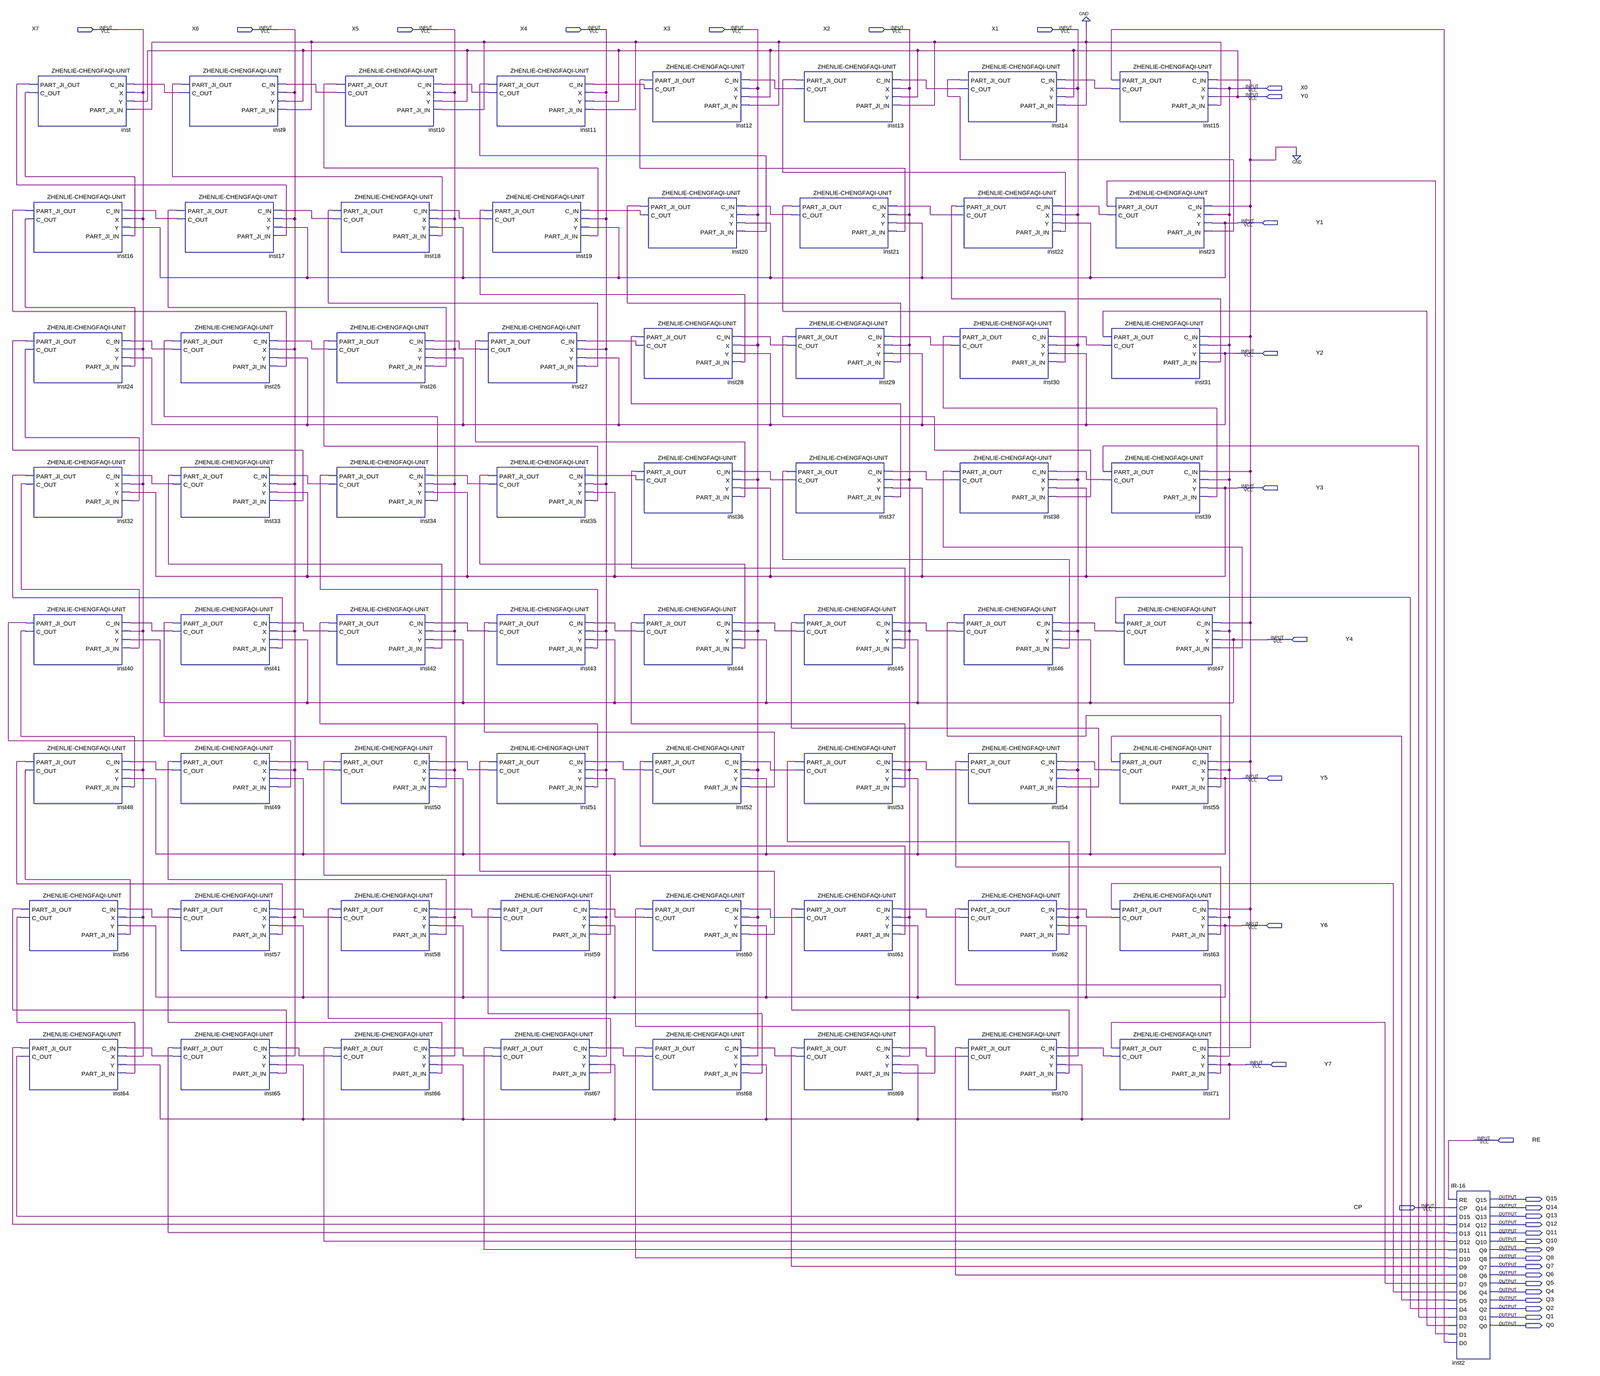
[diagram p0: schematic sheet, whole]
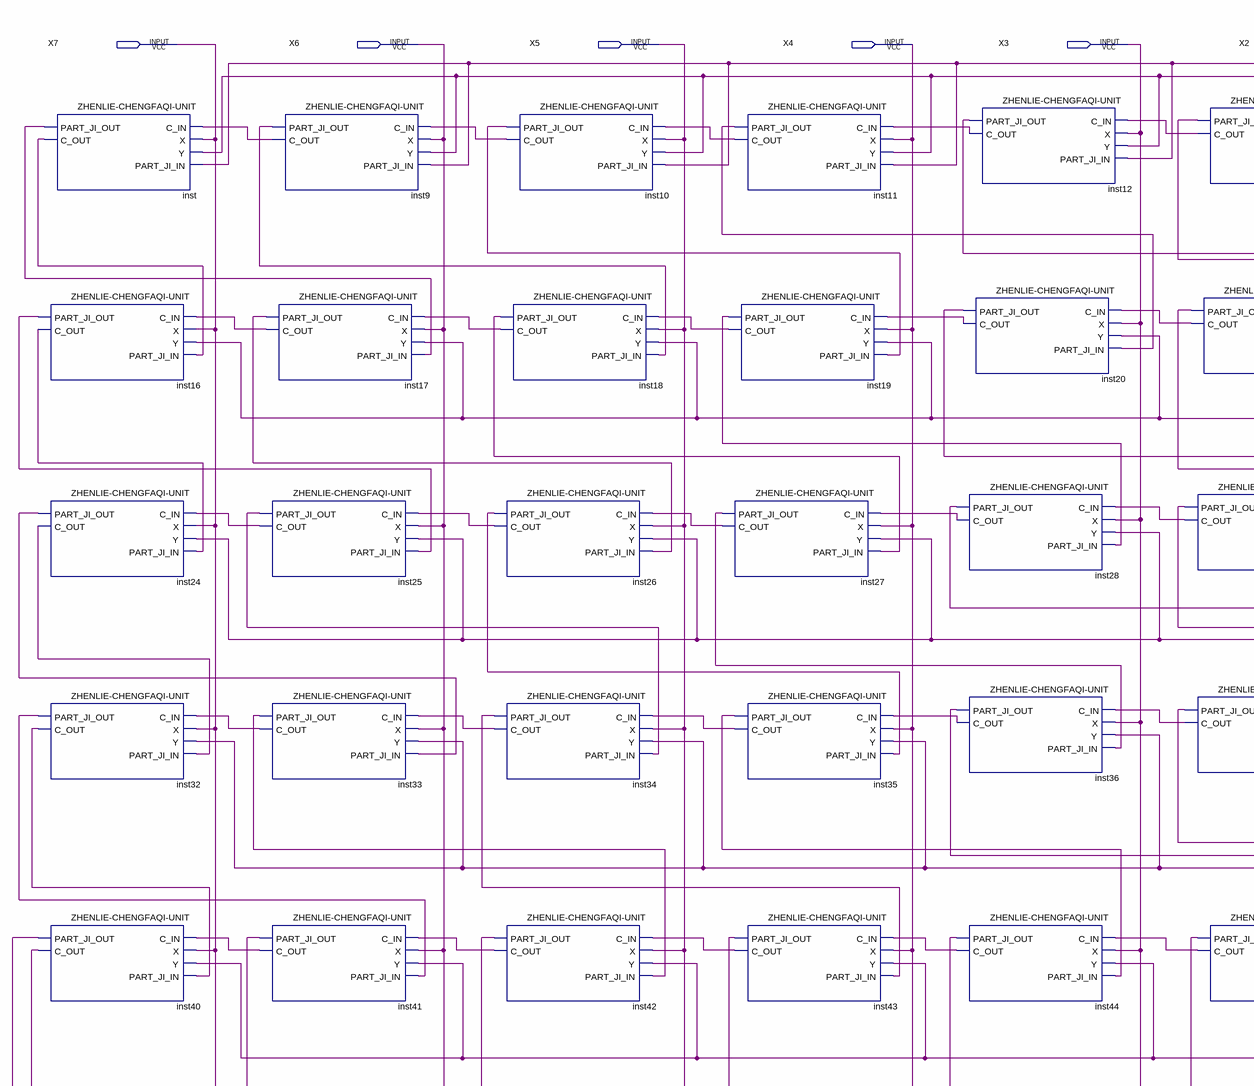
[diagram p1: schematic sheet, upper left part]
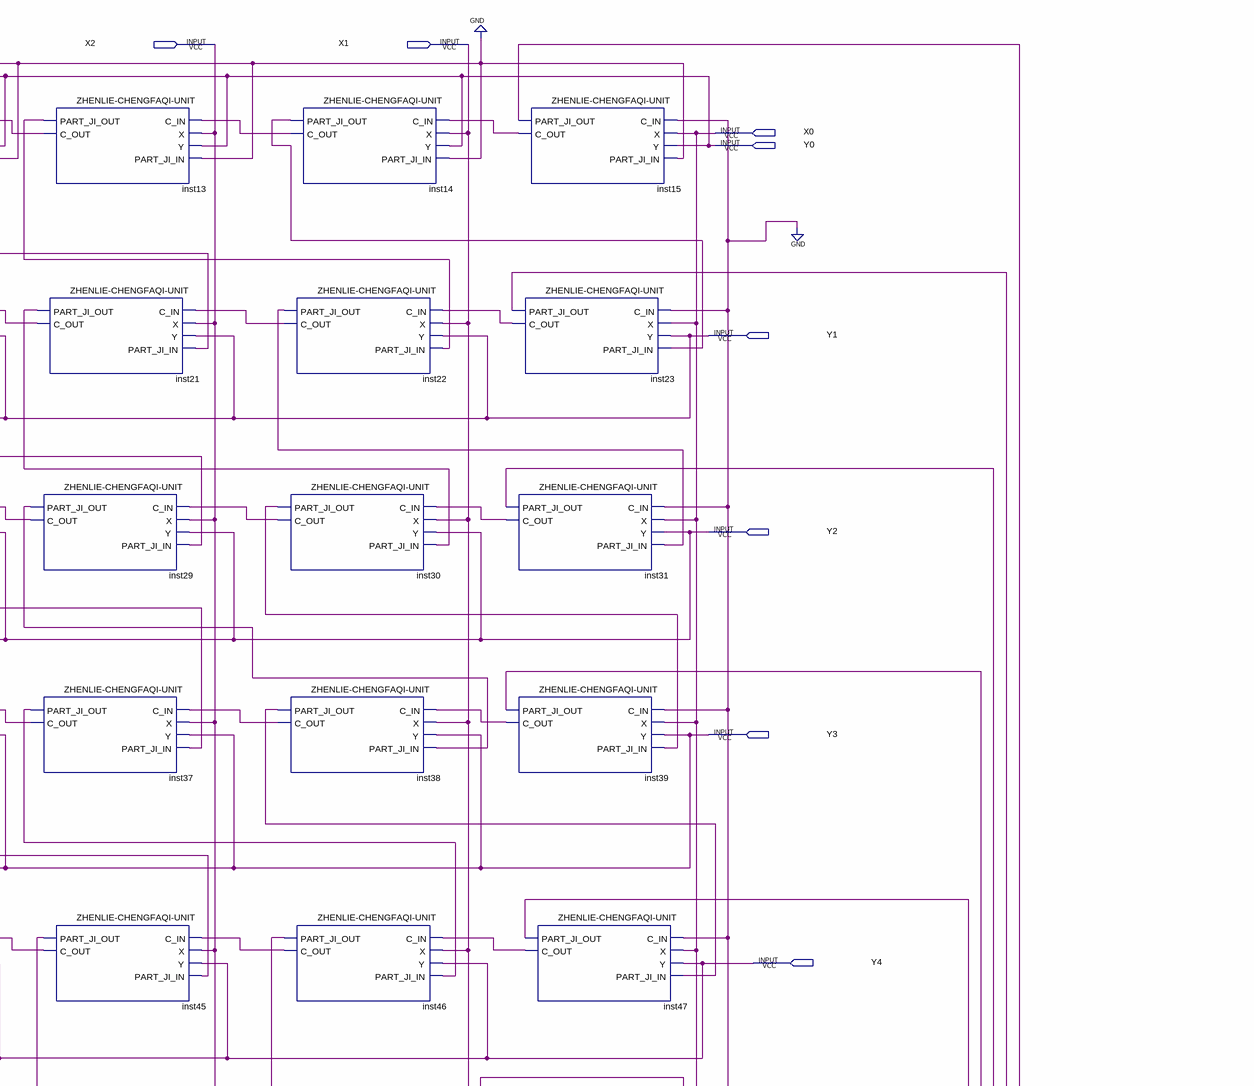
[diagram p2: schematic sheet, upper right part]
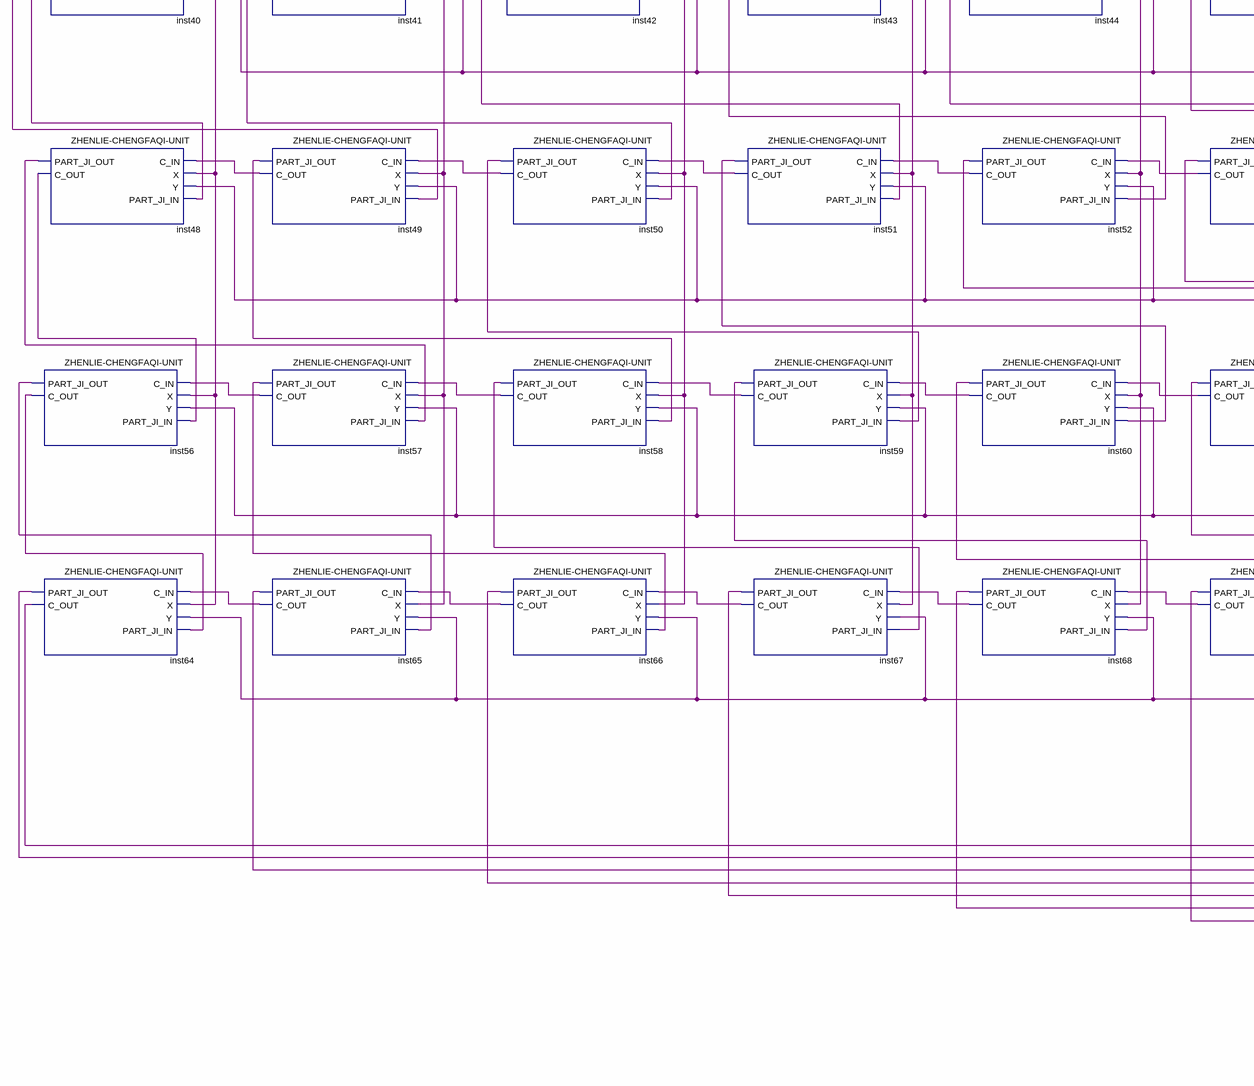
[diagram p3: schematic sheet, lower left part]
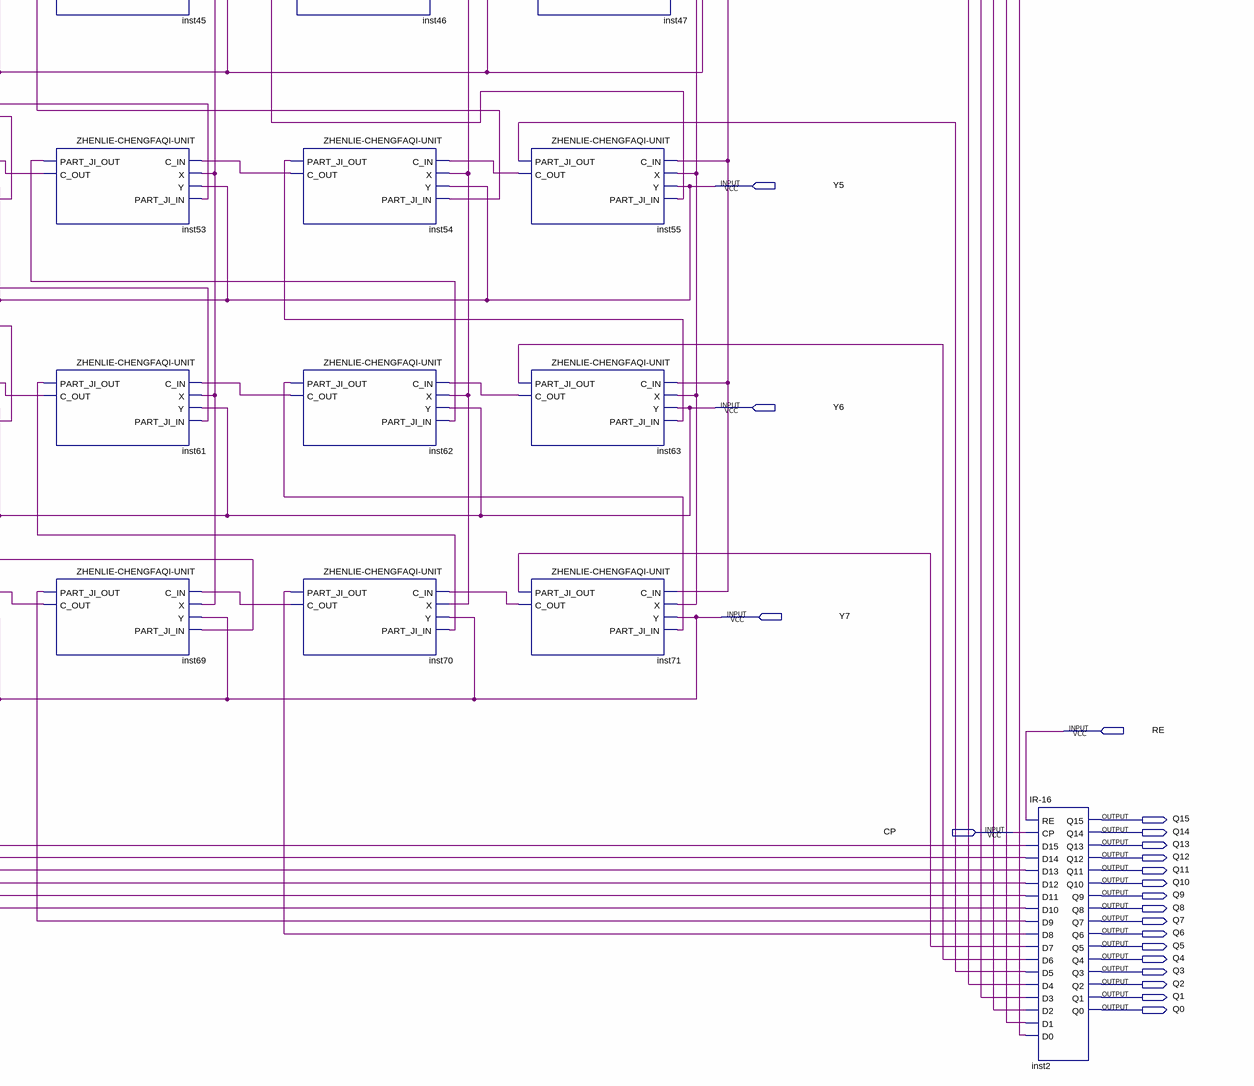
[diagram p4: schematic sheet, lower right part]
// Quartus schematic ZHENLIE-CHENGFAQI.bdf as structural Verilog: 65 symbols, 34 pins
module \ZHENLIE-CHENGFAQI  (
  input  X7,
  input  X6,
  input  X5,
  input  X4,
  input  X3,
  input  X2,
  input  X1,
  input  X0,
  input  Y0,
  input  Y1,
  input  Y2,
  input  Y3,
  input  Y4,
  input  Y5,
  input  Y6,
  input  Y7,
  input  RE,
  input  CP,
  output Q15,
  output Q14,
  output Q13,
  output Q12,
  output Q11,
  output Q10,
  output Q9,
  output Q8,
  output Q7,
  output Q6,
  output Q5,
  output Q4,
  output Q3,
  output Q2,
  output Q1,
  output Q0
);

  wire inst9_c_out, inst9_part_ji_out, inst10_c_out, inst10_part_ji_out, inst11_c_out, inst11_part_ji_out,
       inst12_c_out, inst12_part_ji_out, inst13_c_out, inst13_part_ji_out, inst14_c_out, inst14_part_ji_out,
       inst15_c_out, inst15_part_ji_out, inst16_c_out, inst16_part_ji_out, inst17_c_out, inst17_part_ji_out,
       inst18_c_out, inst18_part_ji_out, inst19_c_out, inst19_part_ji_out, inst20_c_out, inst20_part_ji_out,
       inst21_c_out, inst21_part_ji_out, inst22_c_out, inst22_part_ji_out, inst23_c_out, inst23_part_ji_out,
       inst24_c_out, inst24_part_ji_out, inst25_c_out, inst25_part_ji_out, inst26_c_out, inst26_part_ji_out,
       inst27_c_out, inst27_part_ji_out, inst28_c_out, inst28_part_ji_out, inst29_c_out, inst29_part_ji_out,
       inst30_c_out, inst30_part_ji_out, inst31_c_out, inst31_part_ji_out, inst32_c_out, inst32_part_ji_out,
       inst33_c_out, inst33_part_ji_out, inst34_c_out, inst34_part_ji_out, inst35_c_out, inst35_part_ji_out,
       inst36_c_out, inst36_part_ji_out, inst37_c_out, inst37_part_ji_out, inst38_c_out, inst38_part_ji_out,
       inst39_c_out, inst39_part_ji_out, inst40_c_out, inst40_part_ji_out, inst41_c_out, inst41_part_ji_out,
       inst42_c_out, inst42_part_ji_out, inst43_c_out, inst43_part_ji_out, inst44_c_out, inst44_part_ji_out,
       inst45_c_out, inst45_part_ji_out, inst46_c_out, inst46_part_ji_out, inst47_c_out, inst47_part_ji_out,
       inst48_c_out, inst48_part_ji_out, inst49_c_out, inst49_part_ji_out, inst50_c_out, inst50_part_ji_out,
       inst51_c_out, inst51_part_ji_out, inst52_c_out, inst52_part_ji_out, inst53_c_out, inst53_part_ji_out,
       inst54_c_out, inst54_part_ji_out, inst55_c_out, inst55_part_ji_out, inst56_c_out, inst56_part_ji_out,
       inst57_c_out, inst57_part_ji_out, inst58_c_out, inst58_part_ji_out, inst59_c_out, inst59_part_ji_out,
       inst60_c_out, inst60_part_ji_out, inst61_c_out, inst61_part_ji_out, inst62_c_out, inst62_part_ji_out,
       inst63_c_out, inst63_part_ji_out, inst64_c_out, inst64_part_ji_out, inst65_c_out, inst65_part_ji_out,
       inst66_c_out, inst66_part_ji_out, inst67_c_out, inst67_part_ji_out, inst68_c_out, inst68_part_ji_out,
       inst69_c_out, inst69_part_ji_out, inst70_c_out, inst70_part_ji_out, inst71_c_out, inst71_part_ji_out,
       inst_c_out, inst_part_ji_out;

  \ZHENLIE-CHENGFAQI-UNIT  inst (
    .C_IN(inst9_c_out), .X(X7), .Y(Y0), .PART_JI_IN(1'b0), .PART_JI_OUT(inst_part_ji_out), .C_OUT(inst_c_out));
  \ZHENLIE-CHENGFAQI-UNIT  inst16 (
    .C_IN(inst17_c_out), .X(X7), .Y(Y1), .PART_JI_IN(inst_c_out), .PART_JI_OUT(inst16_part_ji_out),
    .C_OUT(inst16_c_out));
  \ZHENLIE-CHENGFAQI-UNIT  inst24 (
    .C_IN(inst25_c_out), .X(X7), .Y(Y2), .PART_JI_IN(inst16_c_out), .PART_JI_OUT(inst24_part_ji_out),
    .C_OUT(inst24_c_out));
  \ZHENLIE-CHENGFAQI-UNIT  inst32 (
    .C_IN(inst33_c_out), .X(X7), .Y(Y3), .PART_JI_IN(inst24_c_out), .PART_JI_OUT(inst32_part_ji_out),
    .C_OUT(inst32_c_out));
  \ZHENLIE-CHENGFAQI-UNIT  inst40 (
    .C_IN(inst41_c_out), .X(X7), .Y(Y4), .PART_JI_IN(inst32_c_out), .PART_JI_OUT(inst40_part_ji_out),
    .C_OUT(inst40_c_out));
  \ZHENLIE-CHENGFAQI-UNIT  inst48 (
    .C_IN(inst49_c_out), .X(X7), .Y(Y5), .PART_JI_IN(inst40_c_out), .PART_JI_OUT(inst48_part_ji_out),
    .C_OUT(inst48_c_out));
  \ZHENLIE-CHENGFAQI-UNIT  inst56 (
    .C_IN(inst57_c_out), .X(X7), .Y(Y6), .PART_JI_IN(inst48_c_out), .PART_JI_OUT(inst56_part_ji_out),
    .C_OUT(inst56_c_out));
  \ZHENLIE-CHENGFAQI-UNIT  inst64 (
    .C_IN(inst65_c_out), .X(X7), .Y(Y7), .PART_JI_IN(inst56_c_out), .PART_JI_OUT(inst64_part_ji_out),
    .C_OUT(inst64_c_out));
  \ZHENLIE-CHENGFAQI-UNIT  inst25 (
    .C_IN(inst26_c_out), .X(X6), .Y(Y2), .PART_JI_IN(inst16_part_ji_out), .PART_JI_OUT(inst25_part_ji_out),
    .C_OUT(inst25_c_out));
  \ZHENLIE-CHENGFAQI-UNIT  inst33 (
    .C_IN(inst34_c_out), .X(X6), .Y(Y3), .PART_JI_IN(inst24_part_ji_out), .PART_JI_OUT(inst33_part_ji_out),
    .C_OUT(inst33_c_out));
  \ZHENLIE-CHENGFAQI-UNIT  inst41 (
    .C_IN(inst42_c_out), .X(X6), .Y(Y4), .PART_JI_IN(inst32_part_ji_out), .PART_JI_OUT(inst41_part_ji_out),
    .C_OUT(inst41_c_out));
  \ZHENLIE-CHENGFAQI-UNIT  inst49 (
    .C_IN(inst50_c_out), .X(X6), .Y(Y5), .PART_JI_IN(inst40_part_ji_out), .PART_JI_OUT(inst49_part_ji_out),
    .C_OUT(inst49_c_out));
  \ZHENLIE-CHENGFAQI-UNIT  inst57 (
    .C_IN(inst58_c_out), .X(X6), .Y(Y6), .PART_JI_IN(inst48_part_ji_out), .PART_JI_OUT(inst57_part_ji_out),
    .C_OUT(inst57_c_out));
  \ZHENLIE-CHENGFAQI-UNIT  inst65 (
    .C_IN(inst66_c_out), .X(X6), .Y(Y7), .PART_JI_IN(inst56_part_ji_out), .PART_JI_OUT(inst65_part_ji_out),
    .C_OUT(inst65_c_out));
  \ZHENLIE-CHENGFAQI-UNIT  inst9 (
    .C_IN(inst10_c_out), .X(X6), .Y(Y0), .PART_JI_IN(1'b0), .PART_JI_OUT(inst9_part_ji_out),
    .C_OUT(inst9_c_out));
  \ZHENLIE-CHENGFAQI-UNIT  inst17 (
    .C_IN(inst18_c_out), .X(X6), .Y(Y1), .PART_JI_IN(inst_part_ji_out), .PART_JI_OUT(inst17_part_ji_out),
    .C_OUT(inst17_c_out));
  \ZHENLIE-CHENGFAQI-UNIT  inst10 (
    .C_IN(inst11_c_out), .X(X5), .Y(Y0), .PART_JI_IN(1'b0), .PART_JI_OUT(inst10_part_ji_out),
    .C_OUT(inst10_c_out));
  \ZHENLIE-CHENGFAQI-UNIT  inst18 (
    .C_IN(inst19_c_out), .X(X5), .Y(Y1), .PART_JI_IN(inst9_part_ji_out), .PART_JI_OUT(inst18_part_ji_out),
    .C_OUT(inst18_c_out));
  \ZHENLIE-CHENGFAQI-UNIT  inst26 (
    .C_IN(inst27_c_out), .X(X5), .Y(Y2), .PART_JI_IN(inst17_part_ji_out), .PART_JI_OUT(inst26_part_ji_out),
    .C_OUT(inst26_c_out));
  \ZHENLIE-CHENGFAQI-UNIT  inst34 (
    .C_IN(inst35_c_out), .X(X5), .Y(Y3), .PART_JI_IN(inst25_part_ji_out), .PART_JI_OUT(inst34_part_ji_out),
    .C_OUT(inst34_c_out));
  \ZHENLIE-CHENGFAQI-UNIT  inst42 (
    .C_IN(inst43_c_out), .X(X5), .Y(Y4), .PART_JI_IN(inst33_part_ji_out), .PART_JI_OUT(inst42_part_ji_out),
    .C_OUT(inst42_c_out));
  \ZHENLIE-CHENGFAQI-UNIT  inst50 (
    .C_IN(inst51_c_out), .X(X5), .Y(Y5), .PART_JI_IN(inst41_part_ji_out), .PART_JI_OUT(inst50_part_ji_out),
    .C_OUT(inst50_c_out));
  \ZHENLIE-CHENGFAQI-UNIT  inst58 (
    .C_IN(inst59_c_out), .X(X5), .Y(Y6), .PART_JI_IN(inst49_part_ji_out), .PART_JI_OUT(inst58_part_ji_out),
    .C_OUT(inst58_c_out));
  \ZHENLIE-CHENGFAQI-UNIT  inst66 (
    .C_IN(inst67_c_out), .X(X5), .Y(Y7), .PART_JI_IN(inst57_part_ji_out), .PART_JI_OUT(inst66_part_ji_out),
    .C_OUT(inst66_c_out));
  \ZHENLIE-CHENGFAQI-UNIT  inst11 (
    .C_IN(inst12_c_out), .X(X4), .Y(Y0), .PART_JI_IN(1'b0), .PART_JI_OUT(inst11_part_ji_out),
    .C_OUT(inst11_c_out));
  \ZHENLIE-CHENGFAQI-UNIT  inst19 (
    .C_IN(inst20_c_out), .X(X4), .Y(Y1), .PART_JI_IN(inst10_part_ji_out), .PART_JI_OUT(inst19_part_ji_out),
    .C_OUT(inst19_c_out));
  \ZHENLIE-CHENGFAQI-UNIT  inst27 (
    .C_IN(inst28_c_out), .X(X4), .Y(Y2), .PART_JI_IN(inst18_part_ji_out), .PART_JI_OUT(inst27_part_ji_out),
    .C_OUT(inst27_c_out));
  \ZHENLIE-CHENGFAQI-UNIT  inst35 (
    .C_IN(inst36_c_out), .X(X4), .Y(Y3), .PART_JI_IN(inst26_part_ji_out), .PART_JI_OUT(inst35_part_ji_out),
    .C_OUT(inst35_c_out));
  \ZHENLIE-CHENGFAQI-UNIT  inst43 (
    .C_IN(inst44_c_out), .X(X4), .Y(Y4), .PART_JI_IN(inst34_part_ji_out), .PART_JI_OUT(inst43_part_ji_out),
    .C_OUT(inst43_c_out));
  \ZHENLIE-CHENGFAQI-UNIT  inst51 (
    .C_IN(inst52_c_out), .X(X4), .Y(Y5), .PART_JI_IN(inst42_part_ji_out), .PART_JI_OUT(inst51_part_ji_out),
    .C_OUT(inst51_c_out));
  \ZHENLIE-CHENGFAQI-UNIT  inst59 (
    .C_IN(inst60_c_out), .X(X4), .Y(Y6), .PART_JI_IN(inst50_part_ji_out), .PART_JI_OUT(inst59_part_ji_out),
    .C_OUT(inst59_c_out));
  \ZHENLIE-CHENGFAQI-UNIT  inst67 (
    .C_IN(inst68_c_out), .X(X4), .Y(Y7), .PART_JI_IN(inst58_part_ji_out), .PART_JI_OUT(inst67_part_ji_out),
    .C_OUT(inst67_c_out));
  \ZHENLIE-CHENGFAQI-UNIT  inst12 (
    .C_IN(inst13_c_out), .X(X3), .Y(Y0), .PART_JI_IN(1'b0), .PART_JI_OUT(inst12_part_ji_out),
    .C_OUT(inst12_c_out));
  \ZHENLIE-CHENGFAQI-UNIT  inst20 (
    .C_IN(inst21_c_out), .X(X3), .Y(Y1), .PART_JI_IN(inst11_part_ji_out), .PART_JI_OUT(inst20_part_ji_out),
    .C_OUT(inst20_c_out));
  \ZHENLIE-CHENGFAQI-UNIT  inst28 (
    .C_IN(inst29_c_out), .X(X3), .Y(Y2), .PART_JI_IN(inst19_part_ji_out), .PART_JI_OUT(inst28_part_ji_out),
    .C_OUT(inst28_c_out));
  \ZHENLIE-CHENGFAQI-UNIT  inst36 (
    .C_IN(inst37_c_out), .X(X3), .Y(Y3), .PART_JI_IN(inst27_part_ji_out), .PART_JI_OUT(inst36_part_ji_out),
    .C_OUT(inst36_c_out));
  \ZHENLIE-CHENGFAQI-UNIT  inst44 (
    .C_IN(inst45_c_out), .X(X3), .Y(Y4), .PART_JI_IN(inst35_part_ji_out), .PART_JI_OUT(inst44_part_ji_out),
    .C_OUT(inst44_c_out));
  \ZHENLIE-CHENGFAQI-UNIT  inst52 (
    .C_IN(inst53_c_out), .X(X3), .Y(Y5), .PART_JI_IN(inst43_part_ji_out), .PART_JI_OUT(inst52_part_ji_out),
    .C_OUT(inst52_c_out));
  \ZHENLIE-CHENGFAQI-UNIT  inst60 (
    .C_IN(inst61_c_out), .X(X3), .Y(Y6), .PART_JI_IN(inst51_part_ji_out), .PART_JI_OUT(inst60_part_ji_out),
    .C_OUT(inst60_c_out));
  \ZHENLIE-CHENGFAQI-UNIT  inst68 (
    .C_IN(inst69_c_out), .X(X3), .Y(Y7), .PART_JI_IN(inst59_part_ji_out), .PART_JI_OUT(inst68_part_ji_out),
    .C_OUT(inst68_c_out));
  \ZHENLIE-CHENGFAQI-UNIT  inst13 (
    .C_IN(inst14_c_out), .X(X2), .Y(Y0), .PART_JI_IN(1'b0), .PART_JI_OUT(inst13_part_ji_out),
    .C_OUT(inst13_c_out));
  \ZHENLIE-CHENGFAQI-UNIT  inst21 (
    .C_IN(inst22_c_out), .X(X2), .Y(Y1), .PART_JI_IN(inst12_part_ji_out), .PART_JI_OUT(inst21_part_ji_out),
    .C_OUT(inst21_c_out));
  \ZHENLIE-CHENGFAQI-UNIT  inst29 (
    .C_IN(inst30_c_out), .X(X2), .Y(Y2), .PART_JI_IN(inst20_part_ji_out), .PART_JI_OUT(inst29_part_ji_out),
    .C_OUT(inst29_c_out));
  \ZHENLIE-CHENGFAQI-UNIT  inst37 (
    .C_IN(inst38_c_out), .X(X2), .Y(Y3), .PART_JI_IN(inst28_part_ji_out), .PART_JI_OUT(inst37_part_ji_out),
    .C_OUT(inst37_c_out));
  \ZHENLIE-CHENGFAQI-UNIT  inst45 (
    .C_IN(inst46_c_out), .X(X2), .Y(Y4), .PART_JI_IN(inst36_part_ji_out), .PART_JI_OUT(inst45_part_ji_out),
    .C_OUT(inst45_c_out));
  \ZHENLIE-CHENGFAQI-UNIT  inst53 (
    .C_IN(inst54_c_out), .X(X2), .Y(Y5), .PART_JI_IN(inst44_part_ji_out), .PART_JI_OUT(inst53_part_ji_out),
    .C_OUT(inst53_c_out));
  \ZHENLIE-CHENGFAQI-UNIT  inst61 (
    .C_IN(inst62_c_out), .X(X2), .Y(Y6), .PART_JI_IN(inst52_part_ji_out), .PART_JI_OUT(inst61_part_ji_out),
    .C_OUT(inst61_c_out));
  \ZHENLIE-CHENGFAQI-UNIT  inst69 (
    .C_IN(inst70_c_out), .X(X2), .Y(Y7), .PART_JI_IN(inst60_part_ji_out), .PART_JI_OUT(inst69_part_ji_out),
    .C_OUT(inst69_c_out));
  \ZHENLIE-CHENGFAQI-UNIT  inst14 (
    .C_IN(inst15_c_out), .X(X1), .Y(Y0), .PART_JI_IN(1'b0), .PART_JI_OUT(inst14_part_ji_out),
    .C_OUT(inst14_c_out));
  \ZHENLIE-CHENGFAQI-UNIT  inst22 (
    .C_IN(inst23_c_out), .X(X1), .Y(Y1), .PART_JI_IN(inst13_part_ji_out), .PART_JI_OUT(inst22_part_ji_out),
    .C_OUT(inst22_c_out));
  \ZHENLIE-CHENGFAQI-UNIT  inst30 (
    .C_IN(inst31_c_out), .X(X1), .Y(Y2), .PART_JI_IN(inst21_part_ji_out), .PART_JI_OUT(inst30_part_ji_out),
    .C_OUT(inst30_c_out));
  \ZHENLIE-CHENGFAQI-UNIT  inst38 (
    .C_IN(inst39_c_out), .X(X1), .Y(Y3), .PART_JI_IN(inst29_part_ji_out), .PART_JI_OUT(inst38_part_ji_out),
    .C_OUT(inst38_c_out));
  \ZHENLIE-CHENGFAQI-UNIT  inst46 (
    .C_IN(inst47_c_out), .X(X1), .Y(Y4), .PART_JI_IN(inst37_part_ji_out), .PART_JI_OUT(inst46_part_ji_out),
    .C_OUT(inst46_c_out));
  \ZHENLIE-CHENGFAQI-UNIT  inst54 (
    .C_IN(inst55_c_out), .X(X1), .Y(Y5), .PART_JI_IN(inst45_part_ji_out), .PART_JI_OUT(inst54_part_ji_out),
    .C_OUT(inst54_c_out));
  \ZHENLIE-CHENGFAQI-UNIT  inst62 (
    .C_IN(inst63_c_out), .X(X1), .Y(Y6), .PART_JI_IN(inst53_part_ji_out), .PART_JI_OUT(inst62_part_ji_out),
    .C_OUT(inst62_c_out));
  \ZHENLIE-CHENGFAQI-UNIT  inst70 (
    .C_IN(inst71_c_out), .X(X1), .Y(Y7), .PART_JI_IN(inst61_part_ji_out), .PART_JI_OUT(inst70_part_ji_out),
    .C_OUT(inst70_c_out));
  \ZHENLIE-CHENGFAQI-UNIT  inst15 (
    .C_IN(1'b0), .X(X0), .Y(Y0), .PART_JI_IN(1'b0), .PART_JI_OUT(inst15_part_ji_out), .C_OUT(inst15_c_out));
  \ZHENLIE-CHENGFAQI-UNIT  inst23 (
    .C_IN(1'b0), .X(X0), .Y(Y1), .PART_JI_IN(inst14_part_ji_out), .PART_JI_OUT(inst23_part_ji_out),
    .C_OUT(inst23_c_out));
  \ZHENLIE-CHENGFAQI-UNIT  inst31 (
    .C_IN(1'b0), .X(X0), .Y(Y2), .PART_JI_IN(inst22_part_ji_out), .PART_JI_OUT(inst31_part_ji_out),
    .C_OUT(inst31_c_out));
  \ZHENLIE-CHENGFAQI-UNIT  inst39 (
    .C_IN(1'b0), .X(X0), .Y(Y3), .PART_JI_IN(inst30_part_ji_out), .PART_JI_OUT(inst39_part_ji_out),
    .C_OUT(inst39_c_out));
  \ZHENLIE-CHENGFAQI-UNIT  inst47 (
    .C_IN(1'b0), .X(X0), .Y(Y4), .PART_JI_IN(inst38_part_ji_out), .PART_JI_OUT(inst47_part_ji_out),
    .C_OUT(inst47_c_out));
  \ZHENLIE-CHENGFAQI-UNIT  inst55 (
    .C_IN(1'b0), .X(X0), .Y(Y5), .PART_JI_IN(inst46_part_ji_out), .PART_JI_OUT(inst55_part_ji_out),
    .C_OUT(inst55_c_out));
  \ZHENLIE-CHENGFAQI-UNIT  inst63 (
    .C_IN(1'b0), .X(X0), .Y(Y6), .PART_JI_IN(inst54_part_ji_out), .PART_JI_OUT(inst63_part_ji_out),
    .C_OUT(inst63_c_out));
  \ZHENLIE-CHENGFAQI-UNIT  inst71 (
    .C_IN(1'b0), .X(X0), .Y(Y7), .PART_JI_IN(inst62_part_ji_out), .PART_JI_OUT(inst71_part_ji_out),
    .C_OUT(inst71_c_out));
  \IR-16  inst2 (
    .RE(RE), .CP(CP), .D15(inst64_c_out), .D14(inst64_part_ji_out), .D13(inst65_part_ji_out),
    .D12(inst66_part_ji_out), .D11(inst67_part_ji_out), .D10(inst68_part_ji_out), .D9(inst69_part_ji_out),
    .D8(inst70_part_ji_out), .D7(inst71_part_ji_out), .D6(inst63_part_ji_out), .D5(inst55_part_ji_out),
    .D4(inst47_part_ji_out), .D3(inst39_part_ji_out), .D2(inst31_part_ji_out), .D1(inst23_part_ji_out),
    .D0(inst15_part_ji_out), .Q15(Q15), .Q14(Q14), .Q13(Q13), .Q12(Q12), .Q11(Q11), .Q10(Q10), .Q9(Q9),
    .Q8(Q8), .Q7(Q7), .Q6(Q6), .Q5(Q5), .Q4(Q4), .Q3(Q3), .Q2(Q2), .Q1(Q1), .Q0(Q0));
endmodule
